# EasyEDA schematic SCH_New-Project_2024-06-18.json
TITLE: Sheet_1; REV: 1.0; Date: 2024-06-18; Sheet: 1/1; Drawn By: snazzsinclair; Company: Your Company
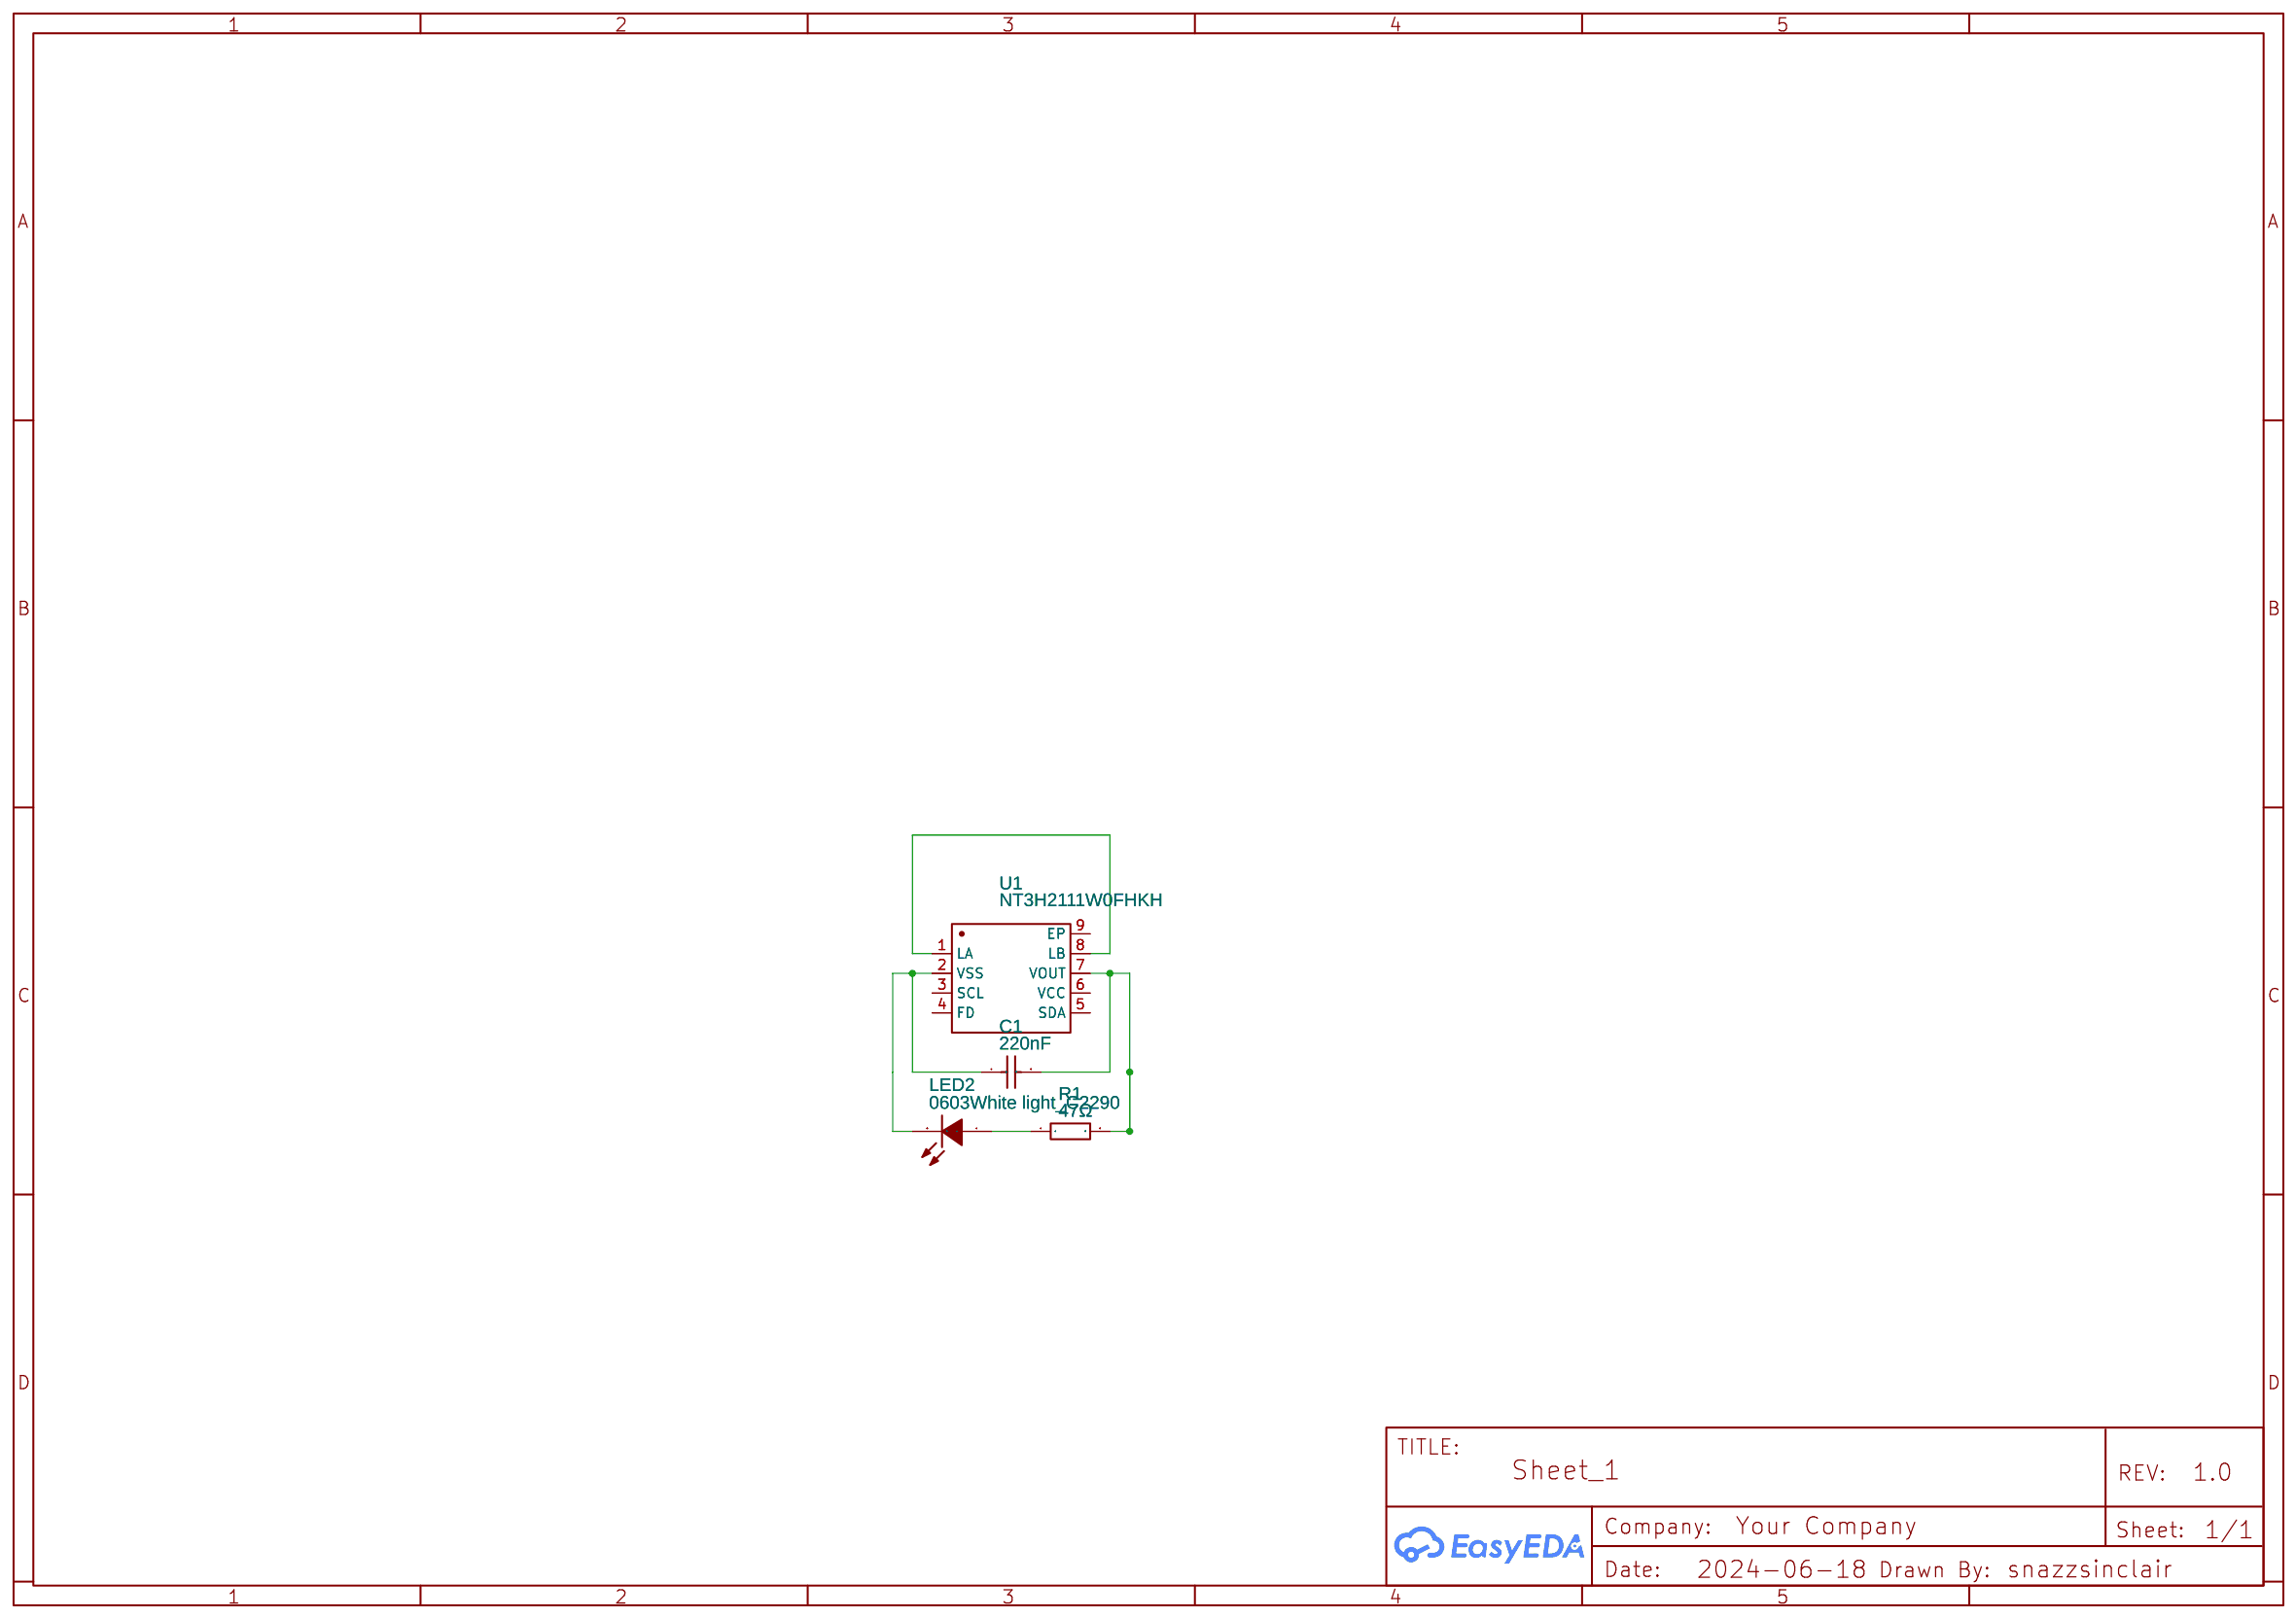
[diagram p0: schematic sheet]

## Parts
C1  220nF  [C0603]
LED2  0603White light_C2290  [LED0603-R-RD_WHITE]
R1  47Ω  [R0603]
U1  NT3H2111W0FHKH  [XQFN-8_L1.6-W1.6-P0.50-BL]

## Library data of the parts
C1 = CL10B224KA8NNNC: Supplier: LCSC; Manufacturer: SAMSUNG(三星); Supplier Part: C21120; JLCPCB Part Class: Basic Part
LED2 = 0603White light_C2290: Supplier: LCSC; Manufacturer: KENTO; Manufacturer Part: KT-0603白灯; Supplier Part: C2290; JLCPCB Part Class: Basic Part
R1 = 0603WAF470JT5E: Supplier: LCSC; Manufacturer: UNI-ROYAL(厚声); Supplier Part: C23182; JLCPCB Part Class: Basic Part
U1 = NT3H2111W0FHKH: Contributor: LCSC; Supplier: LCSC; Supplier Part: C710403; Manufacturer: NXP(恩智浦); JLCPCB Part Class: Extended Part

## Nets
Net-(C1-1): C1.1 LED2.2(K) U1.2(VSS)
Net-(C1-2): C1.2 R1.2 U1.7(VOUT)
Net-(LED2-1): LED2.1(A) R1.1
Net-(U1-1): U1.1(LA) U1.8(LB)

Not connected (* = marked no-connect by the designer): U1 3(SCL) 4(FD) 5(SDA) 6(VCC) 9(EP)
